# EAGLE schematic devcat 04 (EAGLE 5.03)
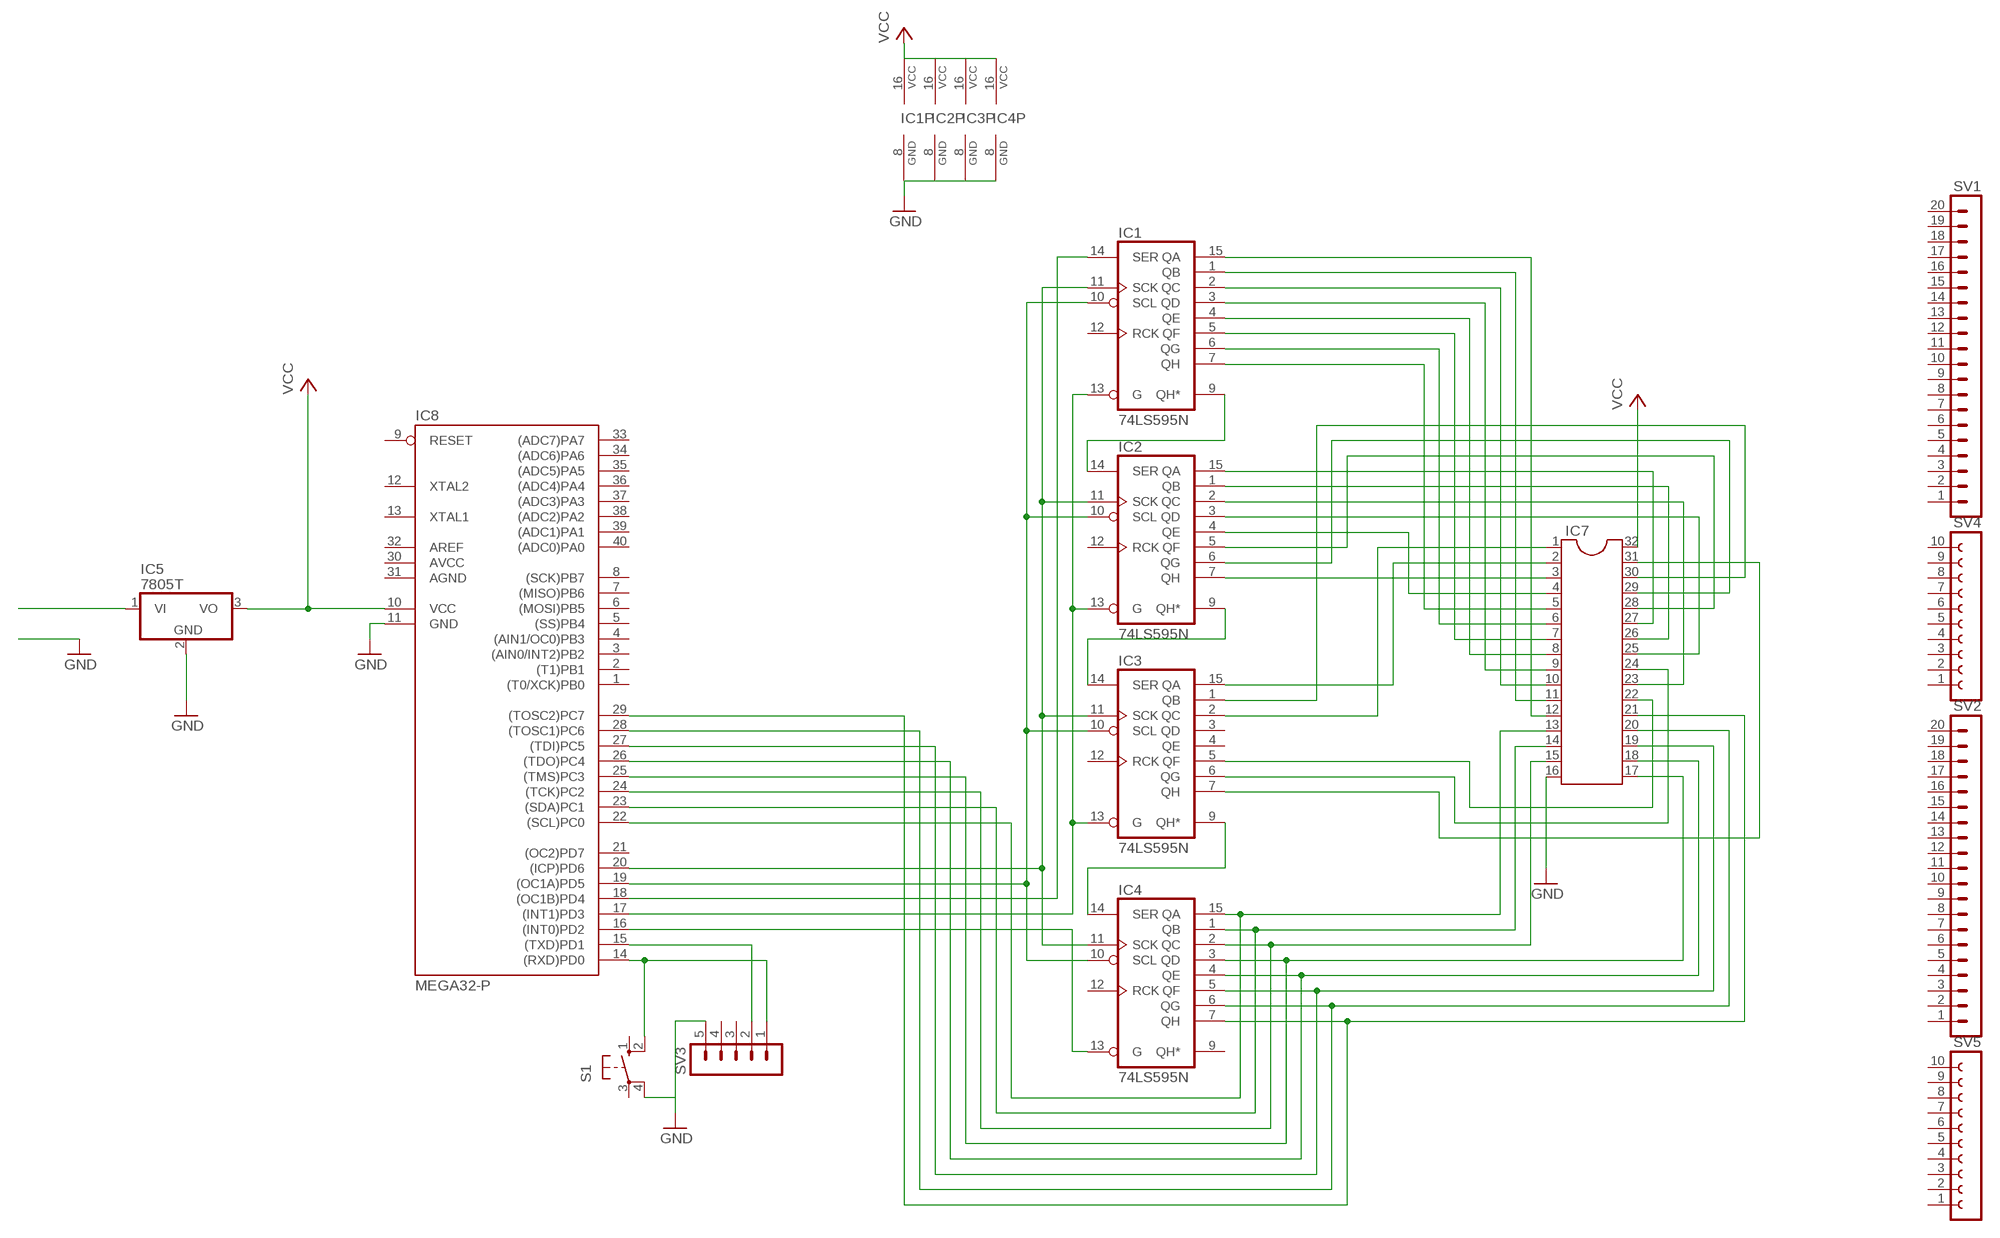
[diagram p0: schematic, sheet 1]

## Parts
IC1  74LS595N  [DIL16]
IC2  74LS595N  [DIL16]
IC3  74LS595N  [DIL16]
IC4  74LS595N  [DIL16]
IC5  7805T  [TO220H]
IC7  DIL32  [DIL32]
IC8  MEGA32-P  [DIL40]
S1  10-XX  [B3F-10XX]
SV1  MA20-1  [MA20-1]
SV2  MA20-1  [MA20-1]
SV3  MA05-1  [MA05-1]
SV4  FE10-1  [FE10]
SV5  FE10-1  [FE10]

## Nets
GND: IC1.8(GND) IC2.8(GND) IC3.8(GND) IC4.8(GND) IC5.2(GND) IC7.16 IC8.11(GND) S1.4(P1) SV3.5
N$1: IC1.15(QA) IC7.12
N$2: IC1.1(QB) IC7.11
N$3: IC1.2(QC) IC7.10
N$4: IC1.3(QD) IC7.9
N$5: IC1.4(QE) IC7.8
N$6: IC1.5(QF) IC7.7
N$7: IC1.6(QG) IC7.6
N$8: IC1.7(QH) IC7.5
N$9: IC2.15(QA) IC7.27
N$10: IC2.1(QB) IC7.26
N$11: IC2.2(QC) IC7.23
N$12: IC2.3(QD) IC7.25
N$13: IC2.4(QE) IC7.4
N$14: IC2.5(QF) IC7.28
N$15: IC2.6(QG) IC7.29
N$16: IC2.7(QH) IC7.3
N$17: IC3.15(QA) IC7.2
N$18: IC3.1(QB) IC7.30
N$19: IC3.5(QF) IC7.22
N$20: IC3.6(QG) IC7.24
N$21: IC3.7(QH) IC7.31
N$22: IC4.15(QA) IC7.13 IC8.22((SCL)PC0)
N$23: IC4.1(QB) IC7.14 IC8.23((SDA)PC1)
N$24: IC4.2(QC) IC7.15 IC8.24((TCK)PC2)
N$25: IC4.3(QD) IC7.17 IC8.25((TMS)PC3)
N$26: IC4.4(QE) IC7.18 IC8.26((TDO)PC4)
N$27: IC4.5(QF) IC7.19 IC8.27((TDI)PC5)
N$28: IC4.6(QG) IC7.20 IC8.28((TOSC1)PC6)
N$29: IC4.7(QH) IC7.21 IC8.29((TOSC2)PC7)
N$30: IC3.2(QC) IC7.1
N$31: IC1.13(G) IC2.13(G) IC3.13(G) IC8.17((INT1)PD3)
N$32: IC4.13(G) IC8.16((INT0)PD2)
N$33: IC1.14(SER) IC8.18((OC1B)PD4)
N$34: IC1.9(QH*) IC2.14(SER)
N$35: IC2.9(QH*) IC3.14(SER)
N$36: IC3.9(QH*) IC4.14(SER)
N$37: IC1.11(SCK) IC2.11(SCK) IC3.11(SCK) IC4.11(SCK) IC8.20((ICP)PD6)
N$38: IC1.10(SCL) IC2.10(SCL) IC3.10(SCL) IC4.10(SCL) IC8.19((OC1A)PD5)
N$39: IC8.14((RXD)PD0) S1.2(S1) SV3.1
N$40: IC8.15((TXD)PD1) SV3.2
N$50: IC5.1(VI)
VCC: IC1.16(VCC) IC2.16(VCC) IC3.16(VCC) IC4.16(VCC) IC5.3(VO) IC7.32 IC8.10(VCC)
Unconnected: IC1.12(RCK) IC2.12(RCK) IC3.3(QD) IC3.4(QE) IC3.12(RCK) IC4.9(QH*) IC4.12(RCK) IC8.1((T0/XCK)PB0) IC8.2((T1)PB1) IC8.3((AIN0/INT2)PB2) IC8.4((AIN1/OC0)PB3) IC8.5((SS)PB4) IC8.6((MOSI)PB5) IC8.7((MISO)PB6) IC8.8((SCK)PB7) IC8.9(RESET) IC8.12(XTAL2) IC8.13(XTAL1) IC8.21((OC2)PD7) IC8.33((ADC7)PA7) IC8.34((ADC6)PA6) IC8.35((ADC5)PA5) IC8.36((ADC4)PA4) IC8.37((ADC3)PA3) IC8.38((ADC2)PA2) IC8.39((ADC1)PA1) IC8.40((ADC0)PA0) S1.1(S) S1.3(P) SV1.1 SV1.2 SV1.3 SV1.4 SV1.5 SV1.6 SV1.7 SV1.8 SV1.9 SV1.10 SV1.11 SV1.12 SV1.13 SV1.14 SV1.15 SV1.16 SV1.17 SV1.18 SV1.19 SV1.20 SV2.1 SV2.2 SV2.3 SV2.4 SV2.5 SV2.6 SV2.7 SV2.8 SV2.9 SV2.10 SV2.11 SV2.12 SV2.13 SV2.14 SV2.15 SV2.16 SV2.17 SV2.18 SV2.19 SV2.20 SV3.3 SV3.4 SV4.1 SV4.2 SV4.3 SV4.4 SV4.5 SV4.6 SV4.7 SV4.8 SV4.9 SV4.10 SV5.1 SV5.2 SV5.3 SV5.4 SV5.5 SV5.6 SV5.7 SV5.8 SV5.9 SV5.10

## Power pins joined to a net without a drawn wire
AGND: IC8.31(AGND)
AREF: IC8.32(AREF)
AVCC: IC8.30(AVCC)

## Library data of the parts
IC1-IC4 = 74xx-us:74*595: 8-bit SHIFT REGISTER, output latch
IC5 = linear:78*: Positive VOLTAGE REGULATOR Source: http://cache.national.com/ds/LM/LM78L05.pdf http://www.fairchildsemi.com/ds/LM/LM7805.pdf
IC7 = ic-package:DIL32: Dual In Line
IC8 = atmel:MEGA32-P: MICROCONTROLLER 32 Kbytes FLASH 2 Kbytes SRAM 1 Kbytes EEPROM USART 8-channel 10 bit ADC Source: www.atmel.com .. doc2503.pdf
S1 = switch-omron:10-XX: OMRON SWITCH
SV1 SV2 = con-lstb:MA20-1: PIN HEADER
SV3 = con-lstb:MA05-1: PIN HEADER
SV4 SV5 = con-lsta:FE10-1: FEMALE HEADER